# Altium schematic sheet Master.SchDoc: Master_circuit
size A4; DrawnBy: A.F.; ProjectName: RFID_system
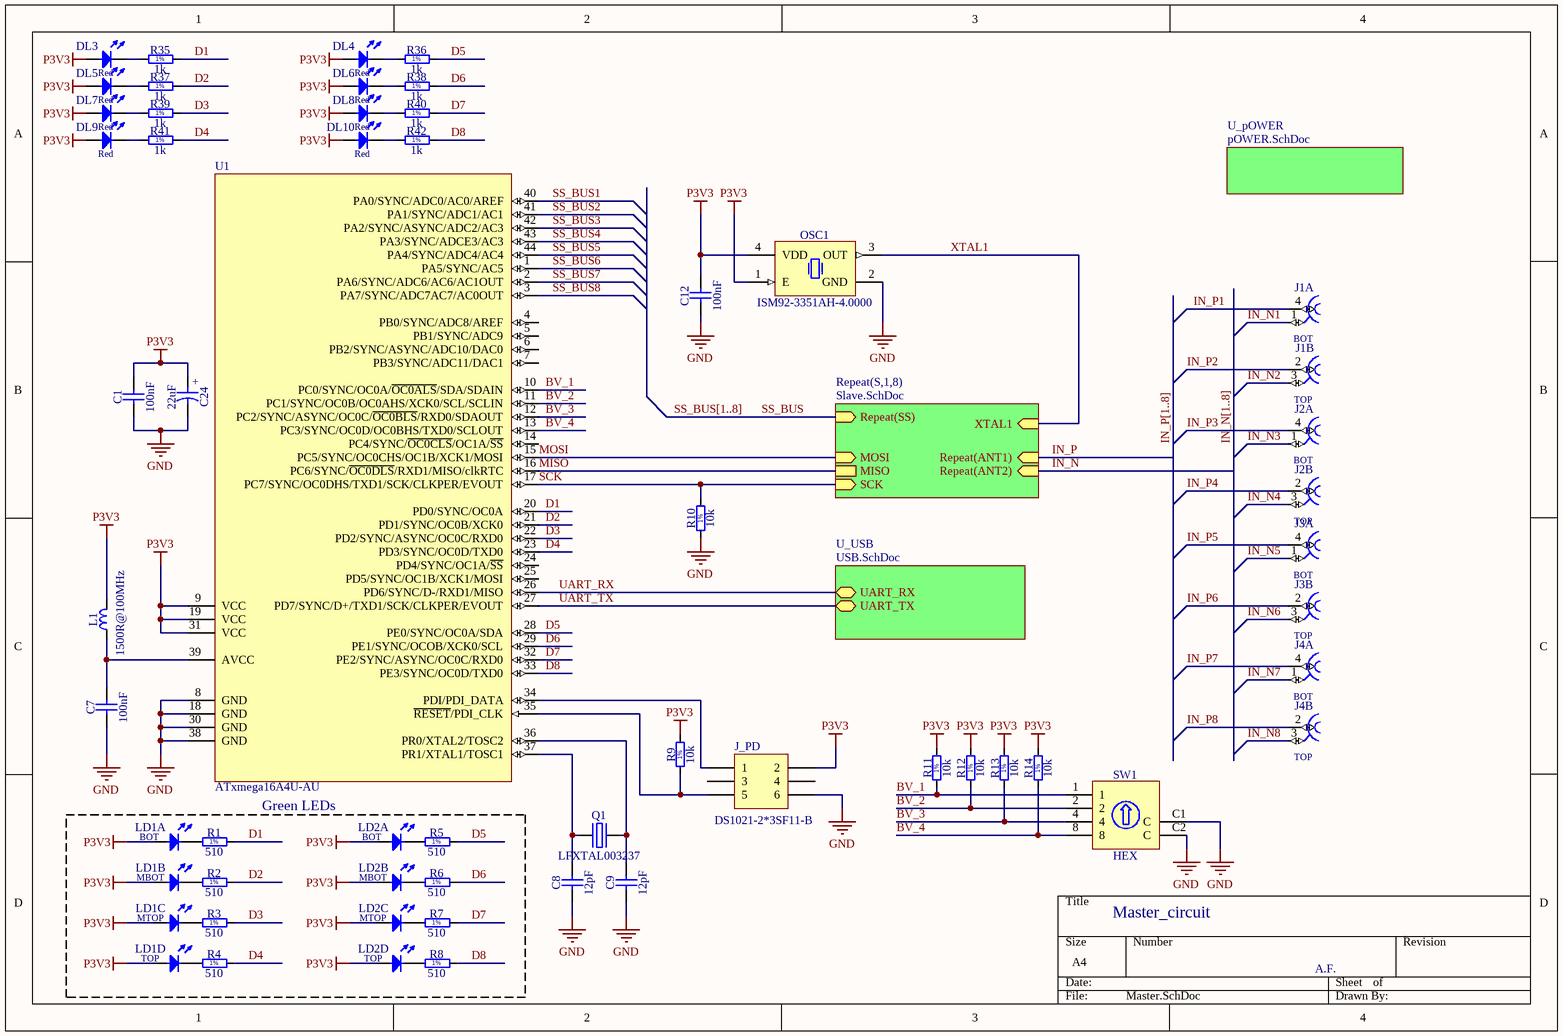
[diagram p0: Master.SchDoc]

## Parts
C1  100nF  [CAPC1608X87N]
C7  100nF  [CAPC1608X87N]
C8  12pF  [CAPC1608X87N]
C9  12pF  [CAPC1608X87N]
C12  100nF  [CAPC1608X87N]
C24  22uF  [CAPAE430X540N]
DL3  Red  [LED_OSRAM_LSR976]
DL4  Red  [LED_OSRAM_LSR976]
DL5  Red  [LED_OSRAM_LSR976]
DL6  Red  [LED_OSRAM_LSR976]
DL7  Red  [LED_OSRAM_LSR976]
DL8  Red  [LED_OSRAM_LSR976]
DL9  Red  [LED_OSRAM_LSR976]
DL10  Red  [LED_OSRAM_LSR976]
J1  Family  [RENHOTEC_RHT-610-0049]  (value not drawn)  (parts A,B of 2)
J2  Family  [RENHOTEC_RHT-610-0049]  (value not drawn)  (parts A,B of 2)
J3  Family  [RENHOTEC_RHT-610-0049]  (value not drawn)  (parts A,B of 2)
J4  Family  [RENHOTEC_RHT-610-0049]  (value not drawn)  (parts A,B of 2)
J_PD  DS1021-2*3SF11-B  [HDR2X3]
L1  1500R@100MHz  [1608[0603]]
LD1  H485CGDL  [LED_BIVAR_H485CGDL]  (value not drawn)  (parts A,B,C,D of 4)
LD2  H485CGDL  [LED_BIVAR_H485CGDL]  (value not drawn)  (parts A,B,C,D of 4)
OSC1  ISM92-3351AH-4.0000  [OSCSC250P320X500X130-4N]
Q1  LFXTAL003237  [XTAL1160X490X430]
R1  510  [RESC1608X55N]
R2  510  [RESC1608X55N]
R3  510  [RESC1608X55N]
R4  510  [RESC1608X55N]
R5  510  [RESC1608X55N]
R6  510  [RESC1608X55N]
R7  510  [RESC1608X55N]
R8  510  [RESC1608X55N]
R9  10k  [RESC1608X55N]
R10  10k  [RESC1608X55N]
R11  10k  [RESC1608X55N]
R12  10k  [RESC1608X55N]
R13  10k  [RESC1608X55N]
R14  10k  [RESC1608X55N]
R35  1k  [RESC1608X50N]
R36  1k  [RESC1608X50N]
R37  1k  [RESC1608X50N]
R38  1k  [RESC1608X50N]
R39  1k  [RESC1608X50N]
R40  1k  [RESC1608X50N]
R41  1k  [RESC1608X50N]
R42  1k  [RESC1608X50N]
SW1  HEX  [SW_OMRON_A6RV-162RF]
U1  ATxmega16A4U-AU  [44A_N]

## Blocks framed on the sheet
Green LEDs: LD1 LD2 R1-R8

## Sub-sheets
Repeat(S,1,8) = Slave.SchDoc: MOSI (in), MISO, SCK (in), Repeat(SS) (in), Repeat(ANT1) (in), Repeat(ANT2) (in), XTAL1 (in)
U_pOWER = pOWER.SchDoc: no entries
U_USB = USB.SchDoc: UART_RX (bidir), UART_TX (bidir)

## Nets
GND: C1.1 C7.1 C8.1 C9.1 C12.1 C24.2 J_PD.6 OSC1.2(GND) R10.1 SW1.C1(C) SW1.C2(C) U1.8(GND) U1.18(GND) U1.30(GND) U1.38(GND)
P3V3: C1.2 C12.2 C24.1 DL3.2(A) DL4.2(A) DL5.2(A) DL6.2(A) DL7.2(A) DL8.2(A) DL9.2(A) DL10.2(A) J_PD.2 L1.2 LD1.2(A) LD1.4(A) LD1.6(A) LD1.8(A) LD2.2(A) LD2.4(A) LD2.6(A) LD2.8(A) OSC1.1(E) OSC1.4(VDD) R9.2 R11.2 R12.2 R13.2 R14.2 U1.9(VCC) U1.19(VCC) U1.31(VCC)
BV_1: R11.1 SW1.1 U1.10(PC0/SYNC/OC0A/~{OC0ALS}/SDA/SDAIN)
BV_2: R12.1 SW1.2 U1.11(PC1/SYNC/OC0B/OC0AHS/XCK0/SCL/SCLIN)
BV_3: R13.1 SW1.4 U1.12(PC2/SYNC/ASYNC/OC0C/~{OC0BLS}/RXD0/SDAOUT)
BV_4: R14.1 SW1.8 U1.13(PC3/SYNC/OC0D/OC0BHS/TXD0/SCLOUT)
D1: R1.2 R35.1 U1.20(PD0/SYNC/OC0A)
D2: R2.2 R37.1 U1.21(PD1/SYNC/OC0B/XCK0)
D3: R3.2 R39.1 U1.22(PD2/SYNC/ASYNC/OC0C/RXD0)
D4: R4.2 R41.1 U1.23(PD3/SYNC/OC0D/TXD0)
D5: R5.2 R36.1 U1.28(PE0/SYNC/OC0A/SDA)
D6: R6.2 R38.1 U1.29(PE1/SYNC/OCOB/XCK0/SCL)
D7: R7.2 R40.1 U1.32(PE2/SYNC/ASYNC/OC0C/RXD0)
D8: R8.2 R42.1 U1.33(PE3/SYNC/OC0D/TXD0)
IN_N: sheet Repeat(S,1,8)/Repeat(ANT2)
IN_N1: J1.1
IN_N2: J1.3
IN_N3: J2.1
IN_N4: J2.3
IN_N5: J3.1
IN_N6: J3.3
IN_N7: J4.1
IN_N8: J4.3
IN_P: sheet Repeat(S,1,8)/Repeat(ANT1)
IN_P1: J1.4
IN_P2: J1.2
IN_P3: J2.4
IN_P4: J2.2
IN_P5: J3.4
IN_P6: J3.2
IN_P7: J4.4
IN_P8: J4.2
MISO: U1.16(PC6/SYNC/~{OC0DLS}/RXD1/MISO/clkRTC) ; sheet Repeat(S,1,8)/MISO
MOSI: U1.15(PC5/SYNC/OC0CHS/OC1B/XCK1/MOSI) ; sheet Repeat(S,1,8)/MOSI
SCK: R10.2 U1.17(PC7/SYNC/OC0DHS/TXD1/SCK/CLKPER/EVOUT) ; sheet Repeat(S,1,8)/SCK
SS_BUS: sheet Repeat(S,1,8)/Repeat(SS)
SS_BUS1: U1.40(PA0/SYNC/ADC0/AC0/AREF)
SS_BUS2: U1.41(PA1/SYNC/ADC1/AC1)
SS_BUS3: U1.42(PA2/SYNC/ASYNC/ADC2/AC3)
SS_BUS4: U1.43(PA3/SYNC/ADCE3/AC3)
SS_BUS5: U1.44(PA4/SYNC/ADC4/AC4)
SS_BUS6: U1.1(PA5/SYNC/AC5)
SS_BUS7: U1.2(PA6/SYNC/ADC6/AC6/AC1OUT)
SS_BUS8: U1.3(PA7/SYNC/ADC7AC7/AC0OUT)
UART_RX: U1.26(PD6/SYNC/D-/RXD1/MISO) ; sheet U_USB/UART_RX
UART_TX: U1.27(PD7/SYNC/D+/TXD1/SCK/CLKPER/EVOUT) ; sheet U_USB/UART_TX
XTAL1: OSC1.3(OUT) ; sheet Repeat(S,1,8)/XTAL1
NetC7_2: C7.2 L1.1 U1.39(AVCC)
NetC8_2: C8.2 Q1.1(OSC1) U1.37(PR1/XTAL1/TOSC1)
NetC9_2: C9.2 Q1.2(OSC2) U1.36(PR0/XTAL2/TOSC2)
NetDL3_1: DL3.1(C) R35.2
NetDL4_1: DL4.1(C) R36.2
NetDL5_1: DL5.1(C) R37.2
NetDL6_1: DL6.1(C) R38.2
NetDL7_1: DL7.1(C) R39.2
NetDL8_1: DL8.1(C) R40.2
NetDL9_1: DL9.1(C) R41.2
NetDL10_1: DL10.1(C) R42.2
NetJ_PD_1: J_PD.1 U1.34(PDI/PDI_DATA)
NetJ_PD_5: J_PD.5 R9.1 U1.35(~{RESET}/PDI_CLK)
NetLD1_1: LD1.1(C) R1.1
NetLD1_3: LD1.3(C) R2.1
NetLD1_5: LD1.5(C) R3.1
NetLD1_7: LD1.7(C) R4.1
NetLD2_1: LD2.1(C) R5.1
NetLD2_3: LD2.3(C) R6.1
NetLD2_5: LD2.5(C) R7.1
NetLD2_7: LD2.7(C) R8.1

Not connected (* = marked no-connect by the designer): J_PD 3 4; U1 4(PB0/SYNC/ADC8/AREF) 5(PB1/SYNC/ADC9) 6(PB2/SYNC/ASYNC/ADC10/DAC0) 7(PB3/SYNC/ADC11/DAC1) 14(PC4/SYNC/~{OC0CLS}/OC1A/~{SS}) 24(PD4/SYNC/OC1A/~{SS}) 25(PD5/SYNC/OC1B/XCK1/MOSI)

## Buses and harness runs
bus IN_N[1..8]
bus IN_P[1..8]
bus SS_BUS[1..8]

## Notes on the sheet
- Labels drawn without touching a wire or pin: \
- (in symbol CAE430-540_22UF_10V_20%) +
- (in symbol CON_BNC_DUAL, part A) BOT
- (in symbol CON_BNC_DUAL, part B) TOP
- (in symbol LED x4 Green 1C2A-BOT_3C4A_5C6A_7C8A-TOP, part A) BOT
- (in symbol LED x4 Green 1C2A-BOT_3C4A_5C6A_7C8A-TOP, part B) MBOT
- (in symbol LED x4 Green 1C2A-BOT_3C4A_5C6A_7C8A-TOP, part C) MTOP
- (in symbol LED x4 Green 1C2A-BOT_3C4A_5C6A_7C8A-TOP, part D) TOP
- (in symbol R0603_10K_1%_0.1W_100PPM) 1%
- (in symbol R0603_510R_1%_0.1W_100PPM) 1%
- (in symbol R0805_1K_1%_0.33W_100PPM_VISHAY_CRCW-HP) 1%

## Library data of the parts
C1 C7 C12 = CC0603_100NF_50V_10%_X5R: Non-polarised capacitor; Part Description: SMD Multilayer Chip Ceramic Capacitor; Manufacturer: GENERIC; Manufacturer1 Part Number: C1608X5R1H104K080AA; Voltage: 50V; TC: X5R; Tolerance: ±10%; Part Number: CC0603_100NF_50V_10%_X5R; Component Kind: Standard; Component Type: Standard; Pin Count: 2; Value: 100nF; Status: None; Manufacturer Part Number: CC0603_100NF_50V_10%_X5R; Case: 0603; Mounted: Yes; Socket: No; SMD: Yes; Sense: No; Manufacturer1 Example: TDK; Manufacturer1 ComponentHeight: 0.9mm; HelpURL: \\cern.ch\dfs\Applications\Altium\Datasheets\CC0603_X5R_TDK_C.pdf; Author: CERN DEM MR; CreateDate: 08.01.2016; LatestRevisionDate: 08.01.2016
C8 C9 = CC0603_12PF_50V_5%_NP0: Non-polarised capacitor; Part Description: SMD Multilayer Chip Ceramic Capacitor; Manufacturer: GENERIC; Manufacturer1 Part Number: 223886715129; Voltage: 50V; TC: C0G/NP0; Tolerance: ±5%; Part Number: CC0603_12PF_50V_5%_NP0; Component Kind: Standard; Component Type: Standard; Pin Count: 2; Value: 12pF; Status: Preferred; Manufacturer Part Number: CC0603_12PF_50V_5%_NP0; Case: 0603; Mounted: Yes; Socket: No; SMD: Yes; Sense: No; Manufacturer1 Example: PHYCOMP; Manufacturer1 ComponentHeight: 0.87mm; HelpURL: \\cern.ch\dfs\Applications\Altium\Datasheets\CC0603_NP0_PHYCOMP.pdf; Author: CERN DEM JLC; CreateDate: 03.12.2007; LatestRevisionDate: 03.12.2007
C24 = CAE430-540_22UF_10V_20%: Polarised capacitor; Part Description: Aluminum Electrolytic SMT Capacitor; Manufacturer: PANASONIC; Manufacturer Part Number: EEEFK1A220AR; Voltage: 10V; Tolerance: ±20%; Part Number: CAE430-540_22UF_10V_20%; Component Kind: Standard; Component Type: Standard; Pin Count: 2; Value: 22uF; Status: Not Recommended; Case: B; Mounted: Yes; Socket: No; SMD: Yes; Sense: No; ComponentHeight: 5.8mm; HelpURL: \\cern.ch\dfs\Applications\Altium\Datasheets\CAE_PANASONIC_FK.pdf; Author: CERN DEM JLC; CreateDate: 2007-12-03; LatestRevisionDate: 2014-11-05
DL3-DL10 = LED_OSRAM_LSR976: LED Red 1C 2A; Part Number: LS R976-NR-1; Part Description: Surface Mount Super Red LED (0805 Case); Manufacturer: OSRAM; Manufacturer Part Number: LSR976; PressFit: No; Bonding: No; Component Kind: Standard; Component Type: Standard; Color: Red; PackageDescription: Super Red Chip LED, 2-Leads, Body 2 x1.25mm, IPC Medium Density; Pin Count: 2; Case: 0805; Mounted: Yes; Socket: No; SMD: Yes; Sense: No; ComponentHeight: 0.9mm; HelpURL: \\cern.ch\dfs\Applications\Altium\Datasheets\LED_OSRAM_LSR976.pdf; Author: CERN DEM JLC; CreateDate: 18.05.2010; LatestRevisionDate: 18.05.2010
J1-J4 = CON_BNC_DUAL: Dual Right Angle 50 Ohm BNC Jack, White Valox Case; Manufacturer: RENHOTEC; Manufacturer Part Number: RHT-610-0049; PressFit: No; Part Number: RENHOTEC_RHT-610-0049; Component Kind: Standard; Component Type: Standard; Pin Count: 6; Family: BNC; Mounted: Yes; Socket: No; SMD: No; Sense: No; Status: None; Part Description: Dual Right Angle 50 Ohm BNC Jack, White Valox Case; ComponentHeight: 29.3mm; HelpURL: \\cern.ch\dfs\Applications\Altium\Datasheets\BOMAR_364A2595.pdf; Author: GK; CreateDate: 09.04.2013; LatestRevisionDate: 09.04.2013
J_PD = Header 3X2: THT Header, 6-Pin, Dual row, 2.54mm pitch; Manufacturer: CONNFLY; LatestRevisionDate: 17-Jul-2002; LatestRevisionNote: Re-released for DXP Platform.; Publisher: Altium Limited; Part Number: DS1021-2*3SF11-B
L1 = IND_1UH_20%_BOURNS_SRP4020TA: Ferrite Bead; Manufacturer: MURATA; Part number: BLM18HE152SN1D; Power: 0.5A; Resistance: 0.5R; Impedence at 100MHZ: 1500R; Footprint: INDC1608X65N; Pin Count: 2; Value: 1500R@100MHz; Status: None; Part Description: Ferrite bead; Mounted: Yes; Socket: No; SMD: Yes; HelpURL: https://www.tme.eu/html/EN/murata-smd-beads/ramka_6596_EN_pelny.html; Author: CERN DEM BC; Producer: Murata
LD1 LD2 = LED x4 Green 1C2A-BOT_3C4A_5C6A_7C8A-TOP: =Part Description; Part Description: Quad-Level 2mm Green LED, PCB Edge Mounting; Manufacturer: BIVAR; Color: Green; PressFit: No; Bonding: No; Part Number: H485CGDL; Component Kind: Standard; Component Type: Standard; PackageDescription: Quad-Level 2mm Green, PCB Edge Mounting  BIVAR H485CHDL; Manufacturer Part Number: H485CGDL; Pin Count: 8; Mounted: Yes; Socket: No; SMD: No; Sense: No; ComponentHeight: 11.3mm; HelpURL: \\cern.ch\dfs\Applications\Altium\Datasheets\LED_BIVAR_H485CGDL.pdf; Author: CERN DEM JLC; CreateDate: 2012-06-04; LatestRevisionDate: 2012-06-04
OSC1 = Oscillator 1E 2GND 3OUT 4VDD: Oscillator 4 pins 3.3V 4MHz; Manufacturer: ILSI; URL: https://www.tme.eu/pl/Document/04fa0ef07f38450711886bdf482cf79c/ISM92_Series.pdf; Part Number: ISM92-3351AH-4.0000
Q1 = XTAL_16MHZ_IQD_LFXTAL003237: =Part Description; Part Description: Tolerance: ± 30ppm, Stability: ± 50ppm, -10°C to +60°C, 16pF, Surface Mount Quartz Crystal, HC49/4HSMX Series; Manufacturer: IQD FREQUENCY PRODUCTS; Value: 16MHz; PressFit: No; Bonding: No; Part Number: LFXTAL003237; Component Kind: Standard; Component Type: Standard; PackageDescription: HC49/4H SMX Case, SMD Cristal, Body 11.6x4.9mm; Manufacturer Part Number: LF XTAL003237; Pin Count: 2; Mounted: Yes; Socket: No; SMD: Yes; Sense: No; ComponentHeight: 4.3mm; HelpURL: \\cern.ch\dfs\Applications\Altium\Datasheets\XTAL_IQD_LFXTAL003237.pdf; Author: CERN DEM MR; CreateDate: 2016-03-23; LatestRevisionDate: 2016-11-07
R1-R8 = R0603_510R_1%_0.1W_100PPM: Resistor - 1%; Part Description: General Purpose Thick Film Chip Resistor; Manufacturer: GENERIC; Manufacturer1 Part Number: NRC06F5100TRF; Power: 0.1W; TC: ±100ppm/°C; PressFit: No; Part Number: R0603_510R_1%_0.1W_100PPM; Component Kind: Standard; Component Type: Standard; Pin Count: 2; Value: 510; Status: Preferred; Tolerance: ±1%; Manufacturer Part Number: R0603_510R_1%_0.1W_100PPM; Case: 0603; Mounted: Yes; Sense: No; Socket: No; SMD: Yes; Manufacturer1 Example: NIC COMPONENT; Manufacturer1 ComponentHeight: 0.55mm; HelpURL: \\cern.ch\dfs\Applications\Altium\Datasheets\R0603_NIC_NRC.pdf; Author: CERN DEM JLC; CreateDate: 2007-12-03; LatestRevisionDate: 2008-03-13
R9-R14 = R0603_10K_1%_0.1W_100PPM: Resistor - 1%; Part Description: General Purpose Thick Film Chip Resistor; Manufacturer: GENERIC; Manufacturer1 Part Number: NRC06F1002TRF; Power: 0.1W; TC: ±100ppm/°C; PressFit: No; Part Number: R0603_10K_1%_0.1W_100PPM; Component Kind: Standard; Component Type: Standard; Pin Count: 2; Value: 10k; Status: Preferred; Tolerance: ±1%; Manufacturer Part Number: R0603_10K_1%_0.1W_100PPM; Case: 0603; Mounted: Yes; Sense: No; Socket: No; SMD: Yes; Manufacturer1 ComponentHeight: 0.55mm; HelpURL: \\cern.ch\dfs\Applications\Altium\Datasheets\R0603_NIC_NRC.pdf; Author: CERN DEM JLC; CreateDate: 03.12.2007; LatestRevisionDate: 13.03.2008; Manufacturer1 Example: NIC COMPONENT
R35-R42 = R0805_1K_1%_0.33W_100PPM_VISHAY_CRCW-HP: Resistor - 1%; Part Description: 150V, Pulse Proof, High Power Thick Film Chip Resistor; Manufacturer: VISHAY DRALORIC; Manufacturer Part Number: CRCW08051K00FKEAHP; Power: 0.33W; TC: ±100ppm/°C; PressFit: No; Part Number: R0805_1K_1%_0.33W_100PPM_VISHAY_CRCW-HP; Component Kind: Standard; Component Type: Standard; Footprint: RESC2012X60N; Pin Count: 2; Value: 1k; Status: None; Tolerance: ±1%; Case: 0805; Mounted: Yes; Sense: No; Socket: No; SMD: Yes; Manufacturer1 ComponentHeight: 0.6mm; HelpURL: \\cern.ch\dfs\Applications\Altium\Datasheets\R0805_VISHAY_CRCW-HP e3.pdf; Author: CERN DEM JLC; CreateDate: 2010-06-16; LatestRevisionDate: 2010-06-16
SW1 = SW_OMRON_A6RV-162RF: Rotary Code Switch 1 2 4 8 C1 C2; Part Number: A6RV-162RF or ERD716RR; Part Description: Side Actuated, Hexadecimal Rotary Code Switch; Manufacturer: OMRON; PressFit: No; Component Kind: Standard; Component Type: Standard; Pin Count: 6; PackageDescription: Body 9.8x6.64mm, Side Actuated, Rotary Code Switch, OMRON A6RV Series; Family: HEX; Mounted: Yes; Socket: No; SMD: No; Sense: No; Status: None; Manufacturer Part Number: A6RV-162RF or ERD716RR; ComponentHeight: 9.9mm; HelpURL: \\cern.ch\dfs\Applications\Altium\Datasheets\SW_OMRON_A6RV.pdf; Author: CERN DEM JLC; CreateDate: 2008-11-27; LatestRevisionDate: 2011-01-19
U1 = ATxmega16A4-AU: 8/16-bit AVR XMEGA A4 Microcontroller, 1.6-3.6V, 16KB + 4KB Flash, 1KB EEPROM, 2KB SRAM, 44-pin TQFP, Industrial Grade (-40°C to 85°C), Pb-Free; Manufacturer: Microchip Technology; Published: 1-Apr-2010; DatasheetVersion: revN, Feb-2010; PackageVersion: rev.B, Oct-2001; PackageReference: 44A; PackageDescription: 44-Pin Plastic Thin Profile Quad Flat Pack, 10 x 10 x 1.0 mm Body, 0.8 mm Pitch (TQFP); ComponentLink1Description: Manufacturer Link; ComponentLink1URL: http://www.atmel.com/products/avr/default.asp?; ComponentLink2Description: ATxmega16A4/32A4/64A4/128A4 Datasheet; ComponentLink2URL: http://www.atmel.com/dyn/resources/prod_documents/doc8069.pdf; ComponentLink3Description: Atmel.com Home; ComponentLink3URL: http://www.atmel.com; Part Number: ATXMEGA16A4-AU; Footprint: TQFP-44